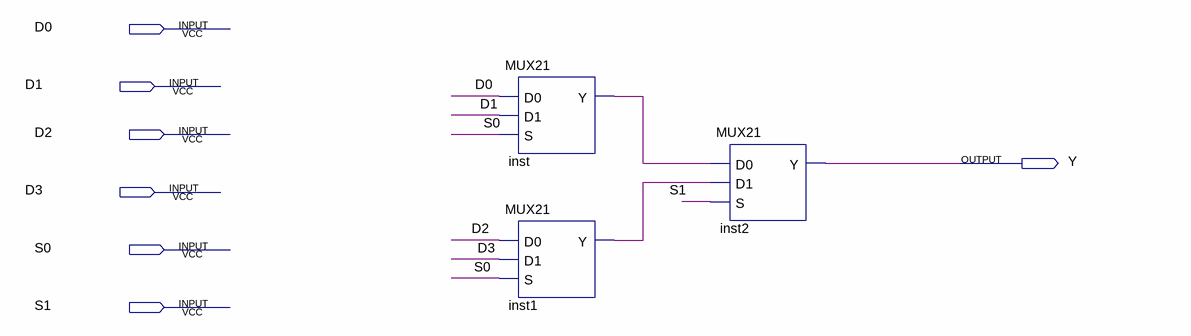
[diagram p0: schematic sheet]
// Quartus schematic MUX41.bdf as structural Verilog: 3 symbols, 7 pins
module MUX41 (
  input  D0,
  input  D1,
  input  D2,
  input  D3,
  input  S0,
  input  S1,
  output Y
);

  wire inst1_y, inst_y;

  MUX21 inst (.D0(D0), .D1(D1), .S(S0), .Y(inst_y));
  MUX21 inst1 (.D0(D2), .D1(D3), .S(S0), .Y(inst1_y));
  MUX21 inst2 (.D0(inst_y), .D1(inst1_y), .S(S1), .Y(Y));
endmodule
